# Altium schematic sheet LB-word-charBuffer.SchDoc
size A
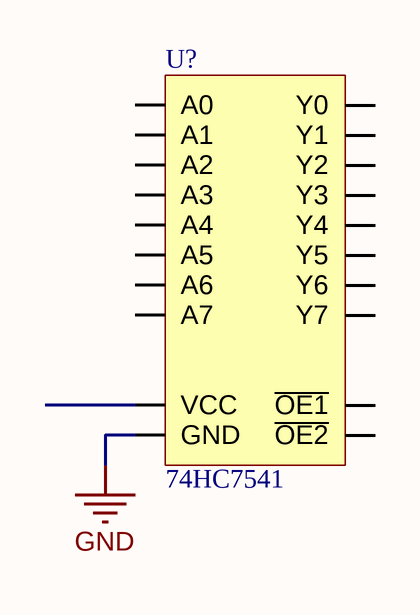
[diagram p0: LB-word-charBuffer.SchDoc]

## Parts
U?  74HC7541  [TSSOP20_N]

## Nets
GND: U?.10(GND)

Not connected (* = marked no-connect by the designer): U? 1(~{OE1}) 2(A0) 3(A1) 4(A2) 5(A3) 6(A4) 7(A5) 8(A6) 9(A7) 11(Y7) 12(Y6) 13(Y5) 14(Y4) 15(Y3) 16(Y2) 17(Y1) 18(Y0) 19(~{OE2}) 20(VCC)

## Library data of the parts
U? = 74HC7541: Schmitt Trigger Octal